# Altium schematic sheet [3] RK3399_PMU.SchDoc
size B; Organization: Altium Limited; Address1: L3, 12a Rodborough Rd; Address2: Frenchs Forest; Address3: NSW; Address4: Australia 2086
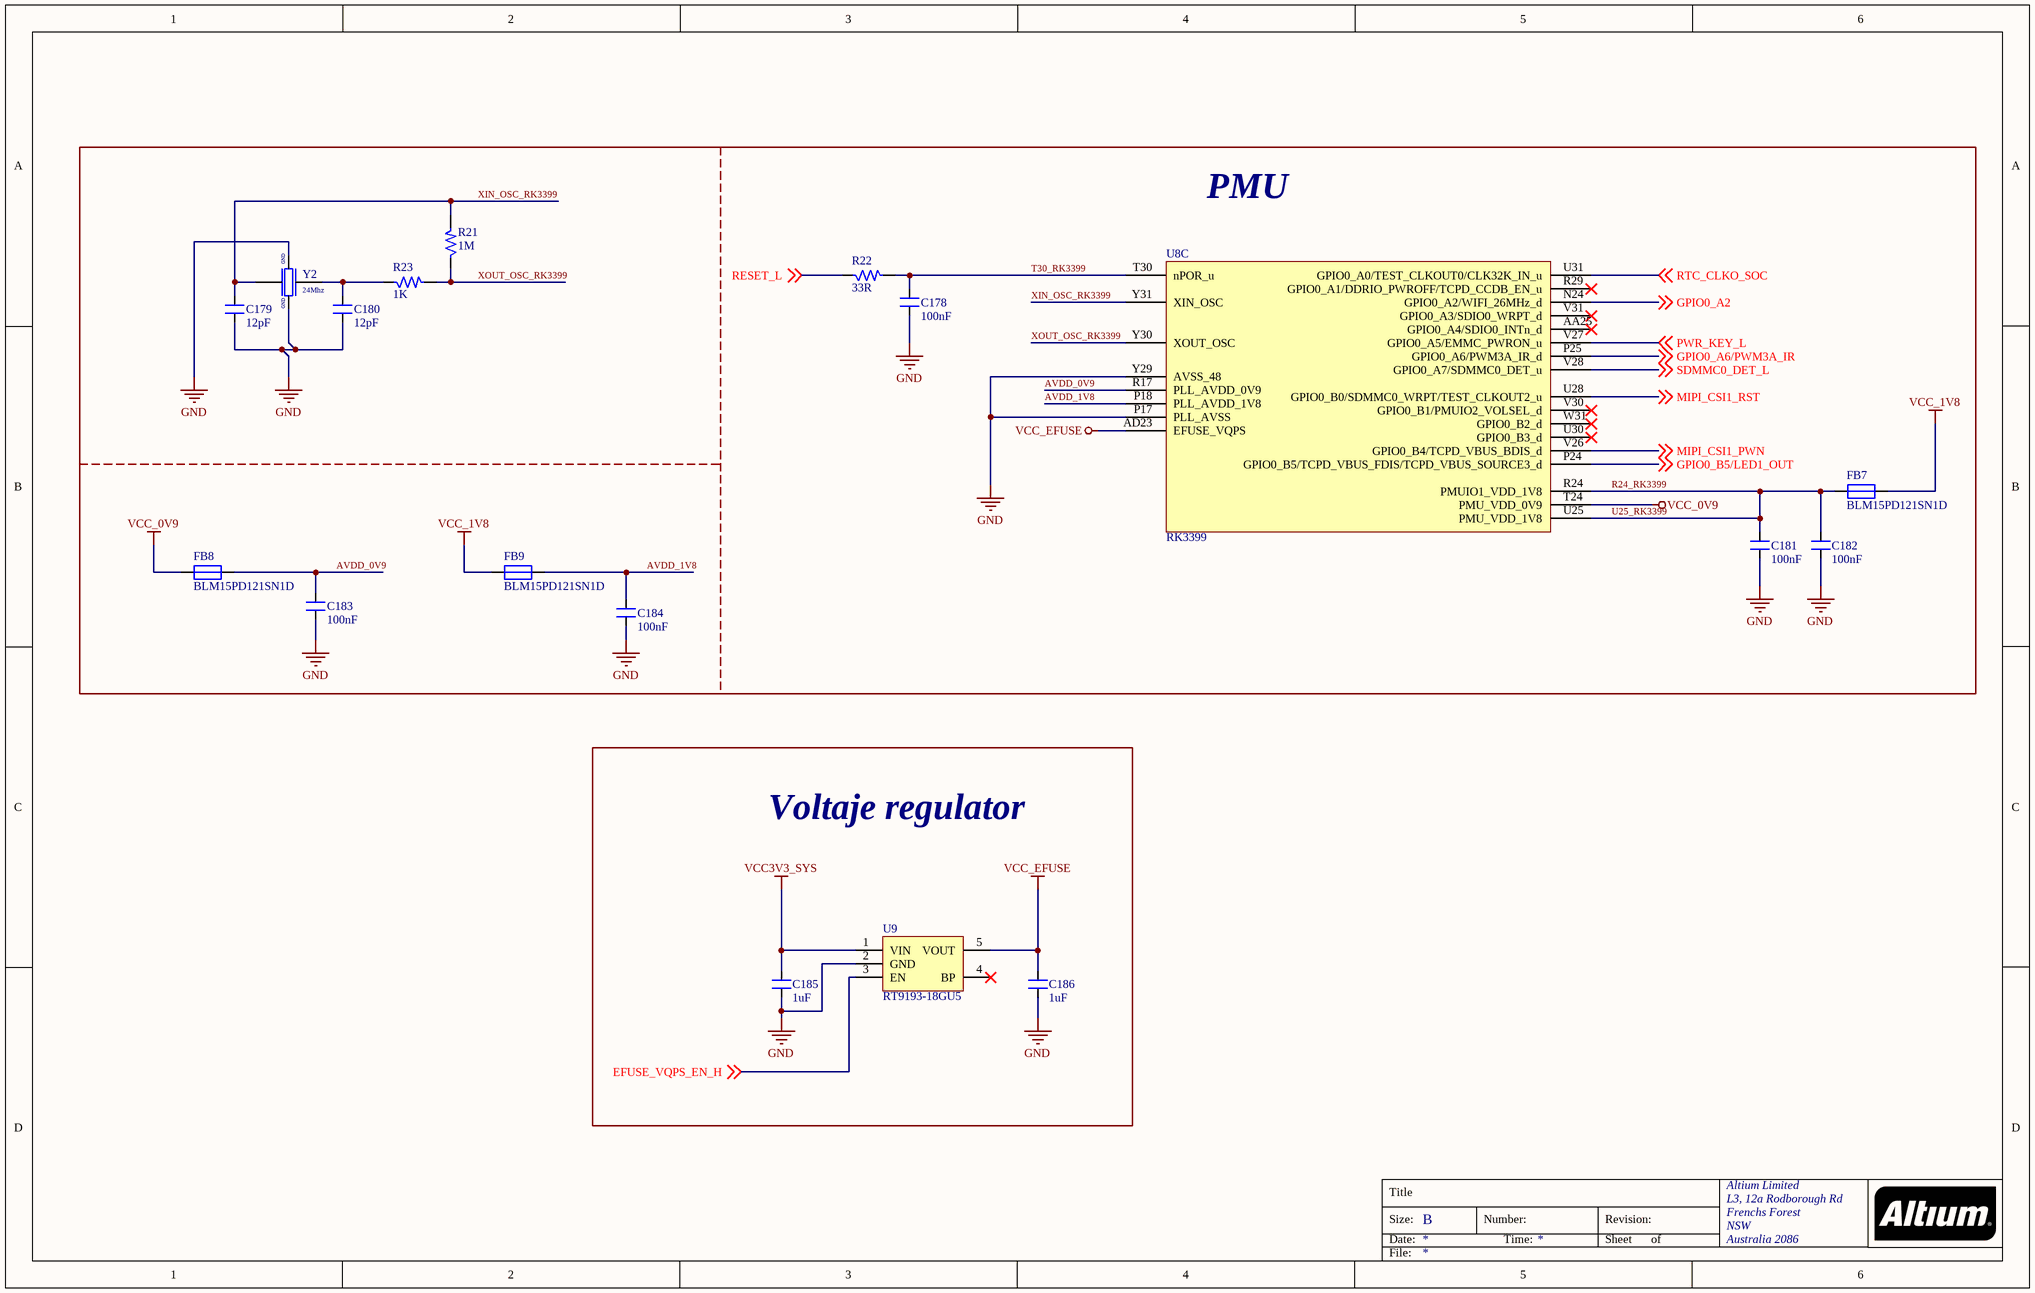
[diagram p0: [3] RK3399_PMU.SchDoc]

## Parts
C178  100nF  [CAP_0201]
C179  12pF  [CAP_0201]
C180  12pF  [CAP_0201]
C181  100nF  [CAP_0201]
C182  100nF  [CAP_0201]
C183  100nF  [CAP_0201]
C184  100nF  [CAP_0201]
C185  1uF  [CAP_0201]
C186  1uF  [CAP_0201]
FB7  BLM15PD121SN1D  [RES_0402]
FB8  BLM15PD121SN1D  [RES_0402]
FB9  BLM15PD121SN1D  [RES_0402]
R21  1M  [RES_0201]
R22  33R  [RES_0201]
R23  1K  [RES_0201]
U8  RK3399  [FBGA828_23_826X826]  (part C of 24)
U9  RT9193-18GU5  [SC70-5]
Y2  24Mhz  [XTAL_ABM8AIG-24.000MHZ-12-2Z-T3]

## Blocks framed on the sheet
PMU: C178-C184 FB7-FB9 R21-R23 U8 Y2
Voltaje regulator: C185 C186 U9

## Nets
GND: C178.1 C179.1 C180.1 C181.1 C182.1 C183.1 C184.1 C185.1 C186.1 U8.P17(PLL_AVSS) U8.Y29(AVSS_48) U9.2(GND) Y2.2 Y2.4
VCC3V3_SYS: C185.2 U9.1(VIN)
VCC_0V9: FB8.1 U8.T24(PMU_VDD_0V9)
VCC_1V8: FB7.2 FB9.1
VCC_EFUSE: C186.2 U8.AD23(EFUSE_VQPS) U9.5(VOUT)
AVDD_0V9: C183.2 FB8.2 U8.R17(PLL_AVDD_0V9)
AVDD_1V8: C184.2 FB9.2 U8.P18(PLL_AVDD_1V8)
EFUSE_VQPS_EN_H: U9.3(EN) ; off-sheet EFUSE_VQPS_EN_H
GPIO0_A2: U8.N24(GPIO0_A2/WIFI_26MHz_d) ; off-sheet GPIO0_A2
GPIO0_A6/PWM3A_IR: U8.P25(GPIO0_A6/PWM3A_IR_d) ; off-sheet GPIO0_A6/PWM3A_IR
GPIO0_B5/LED1_OUT: U8.P24(GPIO0_B5/TCPD_VBUS_FDIS/TCPD_VBUS_SOURCE3_d) ; off-sheet GPIO0_B5/LED1_OUT
MIPI_CSI1_PWN: U8.V26(GPIO0_B4/TCPD_VBUS_BDIS_d) ; off-sheet MIPI_CSI1_PWN
MIPI_CSI1_RST: U8.U28(GPIO0_B0/SDMMC0_WRPT/TEST_CLKOUT2_u) ; off-sheet MIPI_CSI1_RST
PWR_KEY_L: U8.V27(GPIO0_A5/EMMC_PWRON_u) ; off-sheet PWR_KEY_L
R24_RK3399: C181.2 C182.2 FB7.1 U8.R24(PMUIO1_VDD_1V8) U8.U25(PMU_VDD_1V8)  [also labelled U25_RK3399]
RESET_L: R22.1 ; off-sheet RESET_L
RTC_CLKO_SOC: U8.U31(GPIO0_A0/TEST_CLKOUT0/CLK32K_IN_u) ; off-sheet RTC_CLKO_SOC
SDMMC0_DET_L: U8.V28(GPIO0_A7/SDMMC0_DET_u) ; off-sheet SDMMC0_DET_L
T30_RK3399: C178.2 R22.2 U8.T30(nPOR_u)
XIN_OSC_RK3399: C179.2 R21.2 U8.Y31(XIN_OSC) Y2.1
XOUT_OSC_RK3399: R21.1 R23.2 U8.Y30(XOUT_OSC)
NetC180_2: C180.2 R23.1 Y2.3

Not connected (* = marked no-connect by the designer): U8 AA25(GPIO0_A4/SDIO0_INTn_d)* R29(GPIO0_A1/DDRIO_PWROFF/TCPD_CCDB_EN_u)* U30(GPIO0_B3_d)* V30(GPIO0_B1/PMUIO2_VOLSEL_d)* V31(GPIO0_A3/SDIO0_WRPT_d)* W31(GPIO0_B2_d)*; U9 4(BP)*

## Notes on the sheet
- Title
- Size:
- Date:
- B
- Number:
- Time:
- Revision:
- Sheet
- of
- File:
- (in symbol XTAL_24Mhz-12pF-4-SMD) GND

## Library data of the parts
C178 C181-C184 = CAP_100nF-25V-10%-0201: 0.1µF ±10% 25V Ceramic Capacitor X5R 0201 (0603 Metric) /; Manufacturer: TDK Corporation; Manufacturer Part Number: C0603X5R1E104K030BB; Case/Package: 0201; Supplier-1: Digikey
C179 C180 = CAP_12pF-16V-10%-0201: 12pF ±10% 16V Ceramic Capacitor C0G, NP0 0201 (0603 Metric) /; Manufacturer: AVX Corporation; Manufacturer Part Number: 0201YA120KAT2A; Case/Package: 0201; Supplier-1: Digikey
C185 C186 = CAP_1uF-16V-10%-0201: 1µF ±20% 16V Ceramic Capacitor X5R 0201 (0603 Metric) /; Manufacturer: Samsung Electro-Mechanics; Manufacturer Part Number: CL03A105MO3NRNH; Case/Package: 0201; Supplier-1: Digikey
FB7-FB9 = FB_120R-1.3A-100Mhz-0402: 120 Ohms @ 100MHz 1 Power Line Ferrite Bead 0402 (1005 Metric) 1.3A 90mOhm; Manufacturer: Murata Electronics; Mnaufacturer Part Number: BLM15PD121SN1D; Case/Package: 0402; Supplier-1: Digikey
R21 = RES_1M-0.05W-1%-0201: 1 MOhms ±1% 0.05W, 1/20W Chip Resistor 0201 (0603 Metric) Thick Film /; Manufacturer: Yageo; Manufacturer Part Number: RC0201FR-071ML; Case/Package: 0201; Supplier-1: Digikey
R22 = RES_33R-0.05W-1%-0201: 33 Ohms ±1% 0.05W, 1/20W Chip Resistor 0201 (0603 Metric) Thick Film /; Manufacturer: Yageo; Manufacturer Part Number: RC0201FR-0733RL; Case/Package: 0201; Supplier-1: Digikey
R23 = RES_1K-0.05W-1%-0201: 1 kOhms ±1% 0.05W, 1/20W Chip Resistor 0201 (0603 Metric) Thick Film /; Manufacturer: Yageo; Manufacturer Part Number: RC0201FR-071KL; Case/Package: 0201; Supplier-1: Digikey
U8 = IC_RK3399-FCBGA828: RK3399 is a low power, high performance processor for computing, personal mobile.; Manufacturer: Rockchip; Manufacturer Part Number: RK3399; Case/Package: FCBGA828; Supplier-1: Rockchip
U9 = REG_1.8V-300mA-5.5V-SC70-5: Linear Voltage Regulator IC 1 Output 300mA SC-70-5; Manufacturer: Richtek USA Inc.; Manufacturer Part Number: RT9193-18GU5; Case/Package: SC70-5; Supplier-1: Digikey
Y2 = XTAL_24Mhz-12pF-4-SMD: 24MHz ±20ppm Crystal 12pF 50 Ohms 4-SMD, No Lead /; Manufacturer: Abracon LLC; Manufacturer Part Number: ABM8AIG-24.000MHZ-12-2Z-T3; Case/Package: SMD; Supplier-1: Digikey